# Altium schematic sheet MicroSD.SchDoc: CH1 INPUT
size A4; Author: MOG; CompanyName: GIE GROUP; DrawnBy: MOG; Organization: Gie SA; Address1: Galicia 52; Address2: Mar del Plata; Address3: Buenos Aires; Address4: Argentina; DocumentNumber: 13; Revision: 0.0; SheetNumber: 13; SheetTotal: 14; Project: CP DATALOGGER; PageSetup: Record=PageOptions|CenterHorizontal=True|CenterVertical=True|PrintScale=0.94|XCorrection=1.00|YCorrection=1.00|PrintKind=0|BorderSize=5000000|LeftOffset=0|BottomOffset=0|Orientation=2|PaperLength=1000|PaperWidth=1000|Scale=100|PaperSource=7|PrintQuality=720|MediaType=1|DitherType=10|PaperKind=A4|PrintScaleMode=1
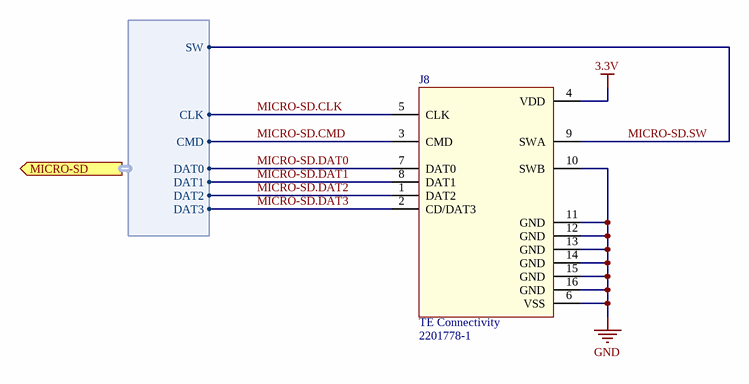
[diagram p0: MicroSD.SchDoc]

## Parts
J8  Manufacturer: TE Connectivity  [TE-2201778-1]  (hidden comment: 2201778-1)

## Ports
MICRO-SD (out, harness MICRO-SD)

## Harnesses
MICRO-SD: SW, CLK, CMD, DAT0, DAT1, DAT2, DAT3

## Nets
3.3V: J8.4(VDD)
GND: J8.6(VSS) J8.10(SWB) J8.11(GND) J8.12(GND) J8.13(GND) J8.14(GND) J8.15(GND) J8.16(GND)
MICRO-SD.CLK: J8.5(CLK) ; port MICRO-SD.CLK
MICRO-SD.CMD: J8.3(CMD) ; port MICRO-SD.CMD
MICRO-SD.DAT0: J8.7(DAT0) ; port MICRO-SD.DAT0
MICRO-SD.DAT1: J8.8(DAT1) ; port MICRO-SD.DAT1
MICRO-SD.DAT2: J8.1(DAT2) ; port MICRO-SD.DAT2
MICRO-SD.DAT3: J8.2(CD/DAT3) ; port MICRO-SD.DAT3
MICRO-SD.SW: J8.9(SWA) ; port MICRO-SD.SW

## Notes on the sheet
- PROYECTO:
- Rev:
- NOMBRE:
- FECHA:
- REALIZO:
- REVISO:
- APROBO:
- PAG:
- HOJA:
- DE
- A4

## Library data of the parts
J8 = 2201778-1: Conn Memory Card RCP 8 POS 1.1mm Solder RA SMD 0.5A/Contact T/R; PartNumber: 2201778-1